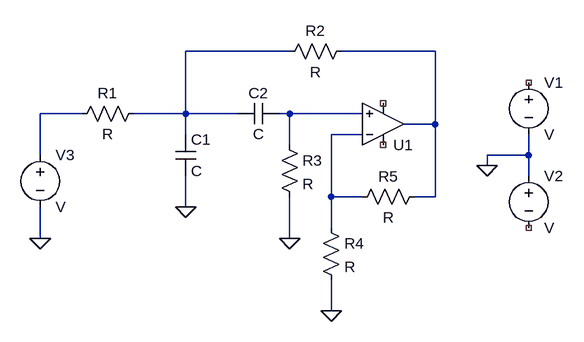
[diagram p0: schematic Draft1.asc]
Draft1.asc, the LTspice schematic file:
Version 4.1
SHEET 1 880 680
WIRE 320 32 160 32
WIRE 544 32 400 32
WIRE 0 128 -64 128
WIRE 160 128 160 32
WIRE 160 128 80 128
WIRE 240 128 160 128
WIRE 320 128 304 128
WIRE 432 128 320 128
WIRE 544 144 544 32
WIRE 544 144 496 144
WIRE 160 160 160 128
WIRE 432 160 384 160
WIRE 320 176 320 128
WIRE -64 192 -64 128
WIRE 688 192 688 160
WIRE 688 192 624 192
WIRE 624 208 624 192
WIRE 688 224 688 192
WIRE 384 256 384 160
WIRE 432 256 384 256
WIRE 544 256 544 144
WIRE 544 256 512 256
WIRE 160 272 160 224
WIRE 384 304 384 256
WIRE -64 320 -64 272
WIRE 320 320 320 256
WIRE 384 432 384 384
FLAG 320 320 0
FLAG 160 272 0
FLAG 384 432 0
FLAG -64 320 0
FLAG 624 208 0
SYMBOL res 96 112 R90
WINDOW 0 0 56 VBottom 2
WINDOW 3 32 56 VTop 2
SYMATTR InstName R1
SYMBOL res 416 16 R90
WINDOW 0 0 56 VBottom 2
WINDOW 3 32 56 VTop 2
SYMATTR InstName R2
SYMBOL res 304 160 R0
SYMATTR InstName R3
SYMBOL res 368 288 R0
SYMATTR InstName R4
SYMBOL res 528 240 R90
WINDOW 0 0 56 VBottom 2
WINDOW 3 32 56 VTop 2
SYMATTR InstName R5
SYMBOL cap 144 160 R0
SYMATTR InstName C1
SYMBOL cap 304 112 R90
WINDOW 0 0 32 VBottom 2
WINDOW 3 32 32 VTop 2
SYMATTR InstName C2
SYMBOL OpAmps\\UniversalOpAmp 464 144 M180
SYMATTR InstName U1
SYMBOL voltage 688 64 R0
SYMATTR InstName V1
SYMBOL voltage 688 208 R0
SYMATTR InstName V2
SYMBOL voltage -64 176 R0
SYMATTR InstName V3

The netlist it stands for:
* Draft1.asc
R1 N001 N003 R
R2 N002 N001 R
R3 N004 0 R
R4 N005 0 R
R5 N002 N005 R
C1 N001 0 C
C2 N004 N001 C
X§U1 N004 N005 NC_01 NC_02 N002 level1 Avol=1Meg GBW=10Meg Vos=0 En=0 Enk=0 In=0 Ink=0 Rin=500Meg  ; pins In+ In- V+ V- OUT
V1 NC_03 0 V
V2 0 NC_04 V
V3 N003 0 V
.lib UniversalOpAmp1.lib
.backanno
.end